# Altium schematic sheet micros.SchDoc: Microcontrollers Stage
size Letter; Author: Daniel Fernández; CompanyName: UAEMéx; DrawnBy: Daniel Fernández; Engineer: Daniel Fernández; Organization: UAEMéx; SheetNumber: 2; SheetTotal: 3; ImagePath: C:\Users\xsteg\Desktop\Logo_de_la_UAEMex.svg
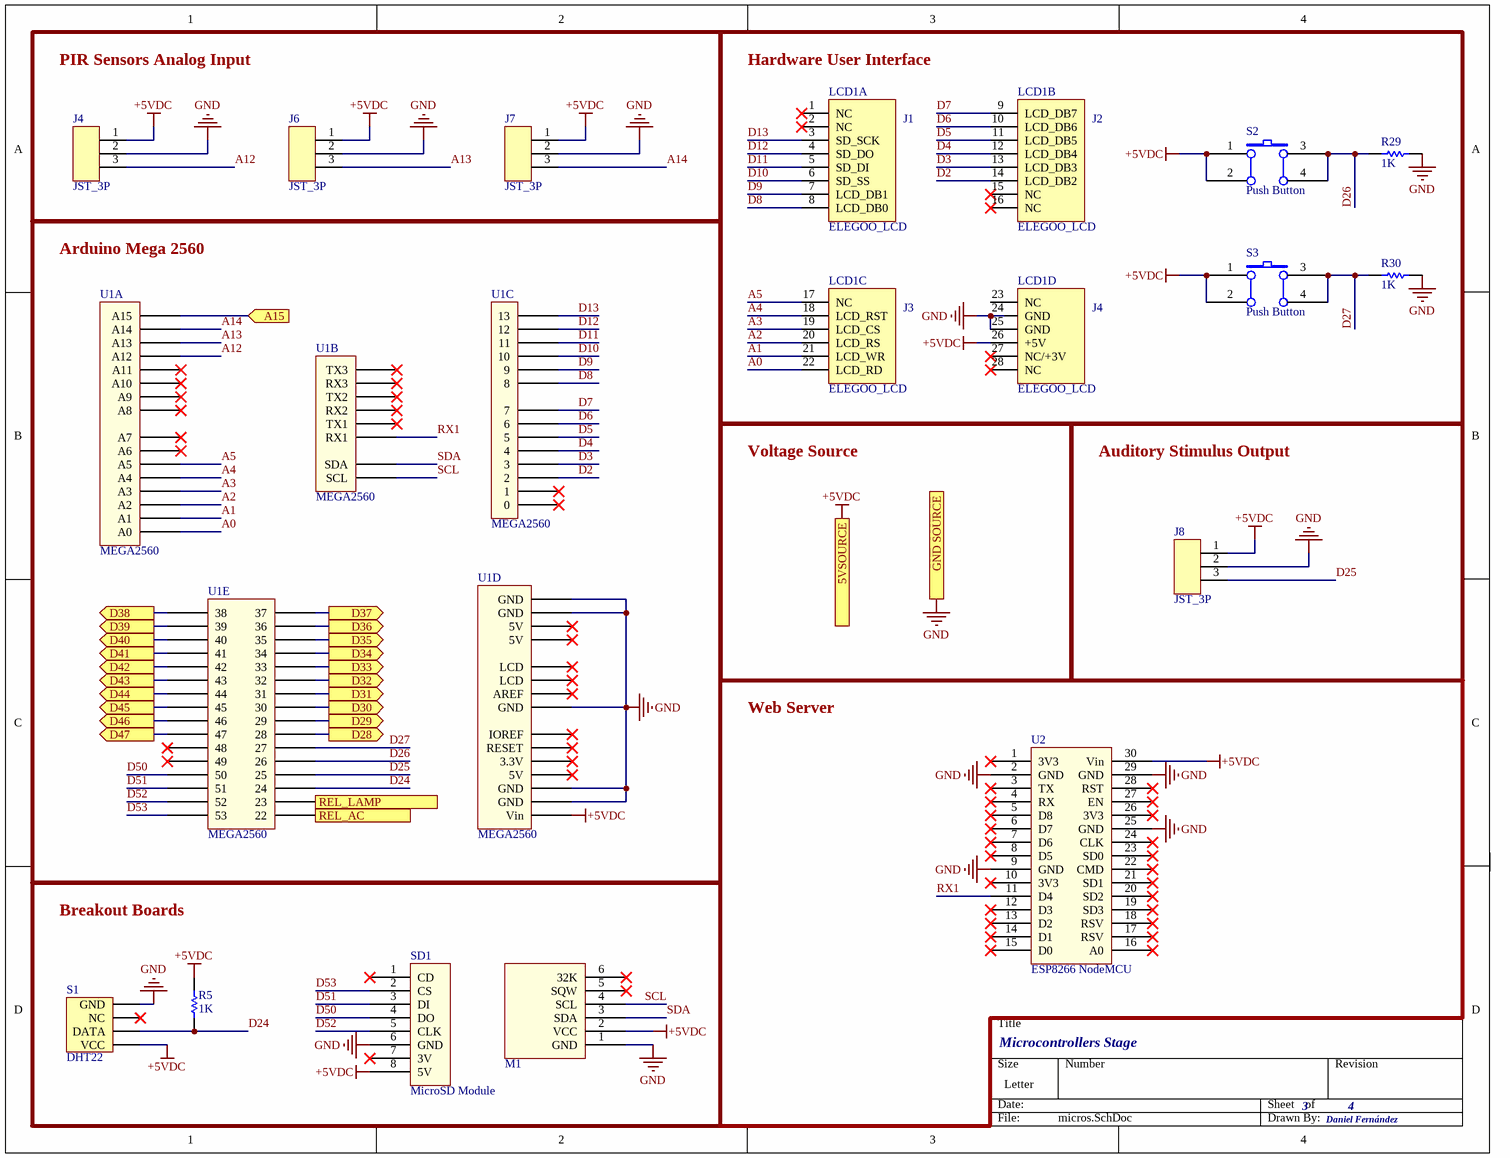
[diagram p0: micros.SchDoc]

## Parts
J4  JST_3P  [JST_3P_ANGLE]
J6  JST_3P  [JST_3P_ANGLE]
J7  JST_3P  [JST_3P_ANGLE]
J8  JST_3P  [JST_3P_ANGLE]
LCD1  ELEGOO_LCD  [Elegoo_LCD]  (parts A,B,C,D of 4)
M1  DS3231  [DS3231_HORIZONTAL]  (value not drawn)
R5  1K  [RESISTOR]
R29  1K  [RESISTOR]
R30  1K  [RESISTOR]
S1  DHT22  [DHT22]
S2  Push Button  [PUSH_BUTTON]
S3  Push Button  [PUSH_BUTTON]
SD1  MicroSD Module  [Micro-SD]
U1  MEGA2560  [MEGA2560_Inv]  (parts A,B,C,D,E of 5)
U2  ESP8266 NodeMCU  [ESP8266_NodeMCU]

## Blocks framed on the sheet
PIR Sensors Analog Input: J4 J6 J7
Hardware User Interface: LCD1 R29 R30 S2 S3
Arduino Mega 2560: U1
Auditory Stimulus Output: J8
Breakout Boards: M1 R5 S1 SD1

## Ports
5VSOURCE (in), A15 (in), D28 (out), D29 (out), D30 (out), D31 (out), D32 (out), D33 (out), D34 (out), D35 (out), D36 (out), D37 (out), D38 (out), D39 (out), D40 (out), D41 (out), D42 (out), D43 (out), D44 (out), D45 (out), D46 (out), D47 (out), GND SOURCE (in), REL_AC (out), REL_LAMP (out)

## Nets
+5VDC: J4.1 J6.1 J7.1 J8.1 LCD1.26(+5V) M1.2(VCC) R5.1 S1.1(VCC) S2.1 S2.2 S3.1 S3.2 SD1.8(5V) U1.Vin U2.30(Vin) ; port 5VSOURCE
GND: J4.2 J6.2 J7.2 J8.2 LCD1.24(GND) LCD1.25(GND) M1.1(GND) R29.2 R30.2 S1.4(GND) SD1.6(GND) U1.GND U1.GND_1(GND) U1.GND_2(GND) U1.GND_3(GND) U1.GND_4(GND) U2.2(GND) U2.9(GND) U2.25(GND) U2.29(GND) ; port GND SOURCE
A0: LCD1.22(LCD_RD) U1.A0
A1: LCD1.21(LCD_WR) U1.A1
A2: LCD1.20(LCD_RS) U1.A2
A3: LCD1.19(LCD_CS) U1.A3
A4: LCD1.18(LCD_RST) U1.A4
A5: LCD1.17(NC) U1.A5
A12: J4.3 U1.A12
A13: J6.3 U1.A13
A14: J7.3 U1.A14
A15: U1.A15 ; port A15
D2: LCD1.14(LCD_DB2) U1.2
D3: LCD1.13(LCD_DB3) U1.3
D4: LCD1.12(LCD_DB4) U1.4
D5: LCD1.11(LCD_DB5) U1.5
D6: LCD1.10(LCD_DB6) U1.6
D7: LCD1.9(LCD_DB7) U1.7
D8: LCD1.8(LCD_DB0) U1.8
D9: LCD1.7(LCD_DB1) U1.9
D10: LCD1.6(SD_SS) U1.10
D11: LCD1.5(SD_DI) U1.11
D12: LCD1.4(SD_DO) U1.12
D13: LCD1.3(SD_SCK) U1.13
D24: R5.2 S1.2(DATA) U1.24
D25: J8.3 U1.25
D26: R29.1 S2.3 S2.4 U1.26
D27: R30.1 S3.3 S3.4 U1.27
D28: U1.28 ; port D28
D29: U1.29 ; port D29
D30: U1.30 ; port D30
D31: U1.31 ; port D31
D32: U1.32 ; port D32
D33: U1.33 ; port D33
D34: U1.34 ; port D34
D35: U1.35 ; port D35
D36: U1.36 ; port D36
D37: U1.37 ; port D37
D38: U1.38 ; port D38
D39: U1.39 ; port D39
D40: U1.40 ; port D40
D41: U1.41 ; port D41
D42: U1.42 ; port D42
D43: U1.43 ; port D43
D44: U1.44 ; port D44
D45: U1.45 ; port D45
D46: U1.46 ; port D46
D47: U1.47 ; port D47
D50: SD1.4(DO) U1.50
D51: SD1.3(DI) U1.51
D52: SD1.5(CLK) U1.52
D53: SD1.2(CS) U1.53
REL_AC: U1.22 ; port REL_AC
REL_LAMP: U1.23 ; port REL_LAMP
RX1: U1.RX1 U2.11(D4)
SCL: M1.4(SCL) U1.SCL
SDA: M1.3(SDA) U1.SDA

Not connected (* = marked no-connect by the designer): LCD1 1(NC)* 2(NC)* 15(NC)* 16(NC)* 23(NC) 27(NC/+3V)* 28(NC)*; M1 5(SQW)* 6(32K)*; S1 3(NC)*; SD1 1(CD)* 7(3V)*; U1 0* 1* 3.3V* 5V* 5V_1(5V)* 5V_2(5V)* 48* 49* A6* A7* A8* A9* A10* A11* AREF* IOREF* LCD* LCD_1(LCD)* RESET* RX2* RX3* TX1* TX2* TX3*; U2 1(3V3)* 3(TX)* 4(RX)* 5(D8)* 6(D7)* 7(D6)* 8(D5)* 10(3V3)* 12(D3)* 13(D2)* 14(D1)* 15(D0)* 16(A0)* 17(RSV)* 18(RSV)* 19(SD3)* 20(SD2)* 21(SD1)* 22(CMD)* 23(SD0)* 24(CLK)* 26(3V3)* 27(EN)* 28(RST)*

## Notes on the sheet
- Voltage Source
- Web Server
- Microcontrollers Stage
- 3
- Daniel Fernández
- 4
- Title
- Size:
- Date:
- Letter
- Number:
- Time:
- Revision:
- Sheet
- of
- File:
- (in symbol ELEGOO_LCD_2.8, part A) J1
- (in symbol ELEGOO_LCD_2.8, part B) J2
- (in symbol ELEGOO_LCD_2.8, part C) J3
- (in symbol ELEGOO_LCD_2.8, part D) J4

## Library data of the parts
LCD1 = ELEGOO_LCD_2.8: LCD 2.8 in - 5 V; Manufacturer: ELEGOO; Manufacturer Code: Elego_LCD_2.8in; Value: 5V - LCD; HelpURL: C:\Varios\PERCRO_DATASHEET\Elegoo 2.8 inch.pdf
M1 = DS3231: RTC MODULE
R5 R29 R30 = Resistor_Axial: Published: 8-Jun-2000; LatestRevisionDate: 17-Jul-2002; LatestRevisionNote: Re-released for DXP Platform.; PackageReference: AXIAL-0.3; Publisher: Altium Limited; PackageDescription: Axial Device, Thru-Hole; 2 Leads; 0.3 in Pin Spacing
S1 = DHT22: Sensor de humedad y temperatura; Manufacturer: Aosong Electronics; Manufacturer Code: DHT22; Height: 25.3 mm; HelpURL: C:\Varios\PERCRO_DATASHEET\DHT22.pdf
S2 S3 = Push_Button_4Pin
SD1 = Micro-SD: Adafruit Micro SD Card Breakout Board
U1 = MEGA2560: Arduino Mega2560
U2 = ESP8266: NODEMCU V2 ESP8266